# Altium project Q24_ECU.PrjPcb (part 2 of 2)

## Sheet Connectors.SchDoc
size A4
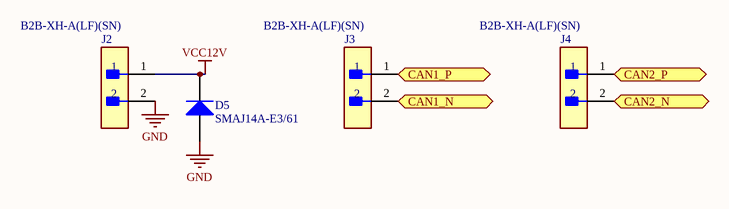
[diagram p6: Connectors.SchDoc]

### Parts
D5  SMAJ14A-E3/61  [VISH-DO-214AC-2_L]
J2  B2B-XH-A(LF)(SN)  [FP-B2B-XH-A_LF_SN-MFG]
J3  B2B-XH-A(LF)(SN)  [FP-B2B-XH-A_LF_SN-MFG]
J4  B2B-XH-A(LF)(SN)  [FP-B2B-XH-A_LF_SN-MFG]

### Ports
CAN1_N (bidir), CAN1_P (bidir), CAN2_N (bidir), CAN2_P (bidir)

### Nets
GND: D5.2(A) J2.2
VCC12V: D5.1(K) J2.1
CAN1_N: J3.2 ; port CAN1_N
CAN1_P: J3.1 ; port CAN1_P
CAN2_N: J4.2 ; port CAN2_N
CAN2_P: J4.1 ; port CAN2_P

### Library data of the parts
D5 = CMP-0548-00224-2: Transient Voltage Suppressor, 6.40 to 231 V, 14 V Stand-off Voltage, Uni-Directional, -55 to 155 degC, 2-pin DO-214AC, Pb-Free, Tape and Reel; Manufacturer: Vishay Semiconductor; PPPM (W): 400, 300; VWM (V): 14; VBR Uni-Directional (V): 6.4 to 231; IFSM: 40 A; ID (uA): 1; PackageDescription: 2-Pin DO-214AC (SMA), Body 4.245 x 2.665 mm; ComponentLink2URL: http://www.vishay.com/docs/88390/smaj50a.pdf; Mounting Technology: Surface Mount; PartNumber: SMAJ14A-E3/61; Operating Junction and Storage Temperature Range: -55 to 150 degC; ComponentLink2Description: Datasheet; Packing: Tape and Reel; PackageReference: DO-214AC-2; ComponentLink3Description: Package Specification; ComponentLink1URL: http://www.vishay.com/; RoHS: TRUE; ComponentLink3URL: http://www.vishay.com/docs/88390/smaj50a.pdf; ComponentLink1Description: Manufacturer URL; DatasheetVersion: 12/8/2013
J2-J4 = CMP-2000-05888-3: CONN HEADER VERT 2POS 2.5MM; Current Rating: 3A; Voltage Rating: 250V; Number of Contacts: 2; Contact Resistance: 20mR; Wire/Cable Gauge: 22AWG; Insulation Resistance: 1GR; Connector Type: Male Pin; Packaging: Bulk; Contact Material: Brass; Lead Free: Lead Free; Orientation: Straight; Contact Plating: Tin; Max Current Rating: 3A; Termination: Solder; Fastening Type: Detent; Depth: 5.75mm; Housing Material: Polyamide; REACH SVHC: No SVHC; Series: XH; Voltage Rating (AC): 250V; Number of Positions: 2; Color: Natural; Contact Type: Male Pin; Max Voltage Rating (DC): 250V; Pitch: 2.5mm; Lead Pitch: 2.5mm; Mount: Through Hole; Max Operating Temperature: 85°C; Length: 7.4mm; Max Voltage Rating (AC): 250V; Min Operating Temperature: -25°C; Number of Rows: 1; Housing Color: White

## Sheet 5VBulkhead.SchDoc
size A4
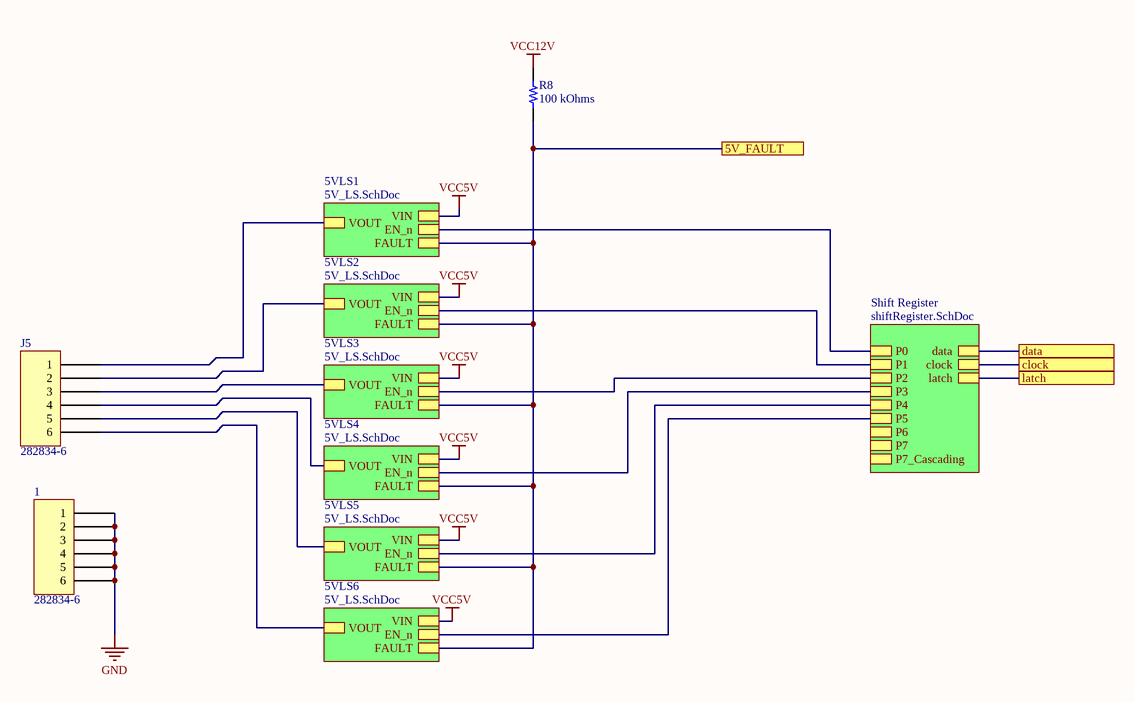
[diagram p7: 5VBulkhead.SchDoc]

### Parts
1  282834-6  [TE 282834-6]
J5  282834-6  [TE 282834-6]
R8  100 kOhms  [RES 0603_1608]

### Sub-sheets
5VLS1 = 5V_LS.SchDoc: VIN, VOUT, EN_n, FAULT
5VLS2 = 5V_LS.SchDoc: VIN, VOUT, EN_n, FAULT
5VLS3 = 5V_LS.SchDoc: VIN, VOUT, EN_n, FAULT
5VLS4 = 5V_LS.SchDoc: VIN, VOUT, EN_n, FAULT
5VLS5 = 5V_LS.SchDoc: VIN, VOUT, EN_n, FAULT
5VLS6 = 5V_LS.SchDoc: VIN, VOUT, EN_n, FAULT
Shift Register = shiftRegister.SchDoc: P0, P1, P2, P3, P4, P5, P6, P7, P7_Cascading, data, clock, latch

### Ports
5V_FAULT, clock, data, latch

### Nets
GND: 1.1 1.2 1.3 1.4 1.5 1.6
VCC5V: sheet 5VLS1/VIN, sheet 5VLS2/VIN, sheet 5VLS3/VIN, sheet 5VLS4/VIN, sheet 5VLS5/VIN, sheet 5VLS6/VIN
VCC12V: R8.2
NetC21_5VLS1_2: J5.1 ; sheet 5VLS1/VOUT
NetC21_5VLS2_2: J5.2 ; sheet 5VLS2/VOUT
NetC21_5VLS3_2: J5.3 ; sheet 5VLS3/VOUT
NetC21_5VLS4_2: J5.4 ; sheet 5VLS4/VOUT
NetC21_5VLS5_2: J5.5 ; sheet 5VLS5/VOUT
NetC21_5VLS6_2: J5.6 ; sheet 5VLS6/VOUT
NetIC2_20: port latch, sheet Shift Register/latch
NetIC2_21: port clock, sheet Shift Register/clock
NetIC2_23: port data, sheet Shift Register/data
NetIC2_42: R8.1 ; port 5V_FAULT, sheet 5VLS1/FAULT, sheet 5VLS2/FAULT, sheet 5VLS3/FAULT, sheet 5VLS4/FAULT, sheet 5VLS5/FAULT, sheet 5VLS6/FAULT
NetIC4_5VLS1_3: sheet Shift Register/P0, sheet 5VLS1/EN_n
NetIC4_5VLS2_3: sheet Shift Register/P1, sheet 5VLS2/EN_n
NetIC4_5VLS3_3: sheet Shift Register/P2, sheet 5VLS3/EN_n
NetIC4_5VLS4_3: sheet Shift Register/P3, sheet 5VLS4/EN_n
NetIC4_5VLS5_3: sheet Shift Register/P4, sheet 5VLS5/EN_n
NetIC4_5VLS6_3: sheet Shift Register/P5, sheet 5VLS6/EN_n

### Library data of the parts
1 J5 = 282834-6: TERM BLK 6P SIDE ENT 2.54MM PCB; Manufacturer: TE Connectivity AMP Connectors; Current: 10A; Mating Orientation: Horizontal with Board; Number of Levels: 1; Pitch: 0.100" (2.54mm); Positions Per Level: 6; Voltage: 150V; Wire Gauge: 16-30 AWG; Wire Termination: Screw - Rising Cage Clamp; Part Number: 282834-6; Color: Green; ComponentLink1Description: Datasheet; ComponentLink1URL: https://www.te.com/commerce/DocumentDelivery/DDEController?Action=srchrtrv&DocNm=282834&DocType=Customer+Drawing&DocLang=English; ComponentLink2Description: DigiKey Link; ComponentLink2URL: http://digikey.com/product-detail/en/te-connectivity-amp-connectors/282834-6/A98337-ND/1153267; LastUpdated: 2020-01-15 4:16:31 AM; Lifecycle Status: Active; Minimum Order: 1; Mounting Type: Through Hole; Packaging: Bulk; Part Status: Active; Price: 4.72; Series: Buchanan; Supplier 1: DigiKey; Supplier Part Number 1: A98337-ND
R8 = RNCS0603BKE100K: RES 100K OHM 0.1% 1/16W 0603; Manufacturer: Stackpole Electronics Inc; Power (Watts): 0.063W, 1/16W; Temperature Coefficient: ±25ppm/°C; Part Number: RNCS0603BKE100K; Value: 100 kOhms; ComponentLink1Description: Datasheet; ComponentLink1URL: https://www.seielect.com/catalog/sei-rncs_rnch.pdf; ComponentLink2Description: DigiKey Link; ComponentLink2URL: https://www.digikey.com/en/products/detail/stackpole-electronics-inc/RNCS0603BKE100K/1708835; Composition: Thin Film; Device Package: 0603 (1608 Metric); Features: Anti-Corrosive, Automotive AEC-Q200, Moisture Resistant; Height - Seated (Max): 0.022" (0.55mm); LastUpdated: 2023-06-08 7:45:17 PM; Lifecycle Status: Active; Minimum Order: 1; Number of Terminations: 2; Operating Temperature: -55°C ~ 155°C; Package / Case: 0603 (1608 Metric); Packaging: TapeAndReel; PartId: 4849; Part Status: Active; Price: 0.07; Ratings: AEC-Q200; Resistance: 100 kOhms; Series: RNCS; Size / Dimension: 0.061" L x 0.031" W (1.55mm x 0.80mm); Supplier 1: DigiKey; Supplier Part Number 1: RNCS0603BKE100KCT-ND; Supplier Device Package: 0603; Tolerance: ±0.1%

## Sheet shiftRegister.SchDoc
size A4
Used 2 times, as channels 5V Power and Ground/Shift Register, 12V Power And Ground/Shift Register. Parts and nets are listed once, with the designators drawn on the sheet.
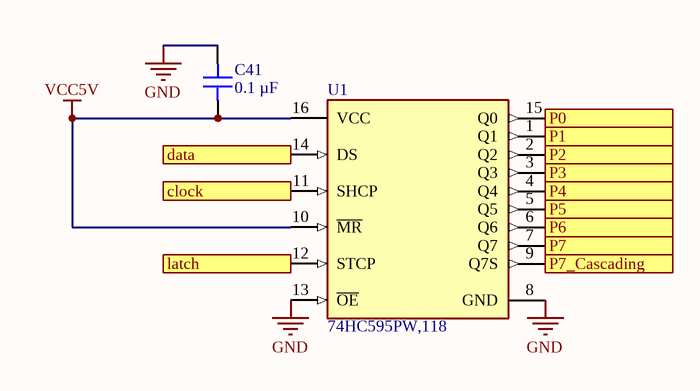
[diagram p8: shiftRegister.SchDoc]

### Parts
C41  0.1 µF  [CAP 0603_1608]
U1  74HC595PW,118  [FP-SOT403-1-MFG]

### Ports
clock, data, latch, P0, P1, P2, P3, P4, P5, P6, P7, P7_Cascading

### Nets
GND: C41.2 U1.8(GND) U1.13(~{OE})
VCC5V: C41.1 U1.10(~{MR}) U1.16(VCC)
clock: U1.11(SHCP) ; port clock
data: U1.14(DS) ; port data
latch: U1.12(STCP) ; port latch
P0: U1.15(Q0) ; port P0
P1: U1.1(Q1) ; port P1
P2: U1.2(Q2) ; port P2
P3: U1.3(Q3) ; port P3
P4: U1.4(Q4) ; port P4
P5: U1.5(Q5) ; port P5
P6: U1.6(Q6) ; port P6
P7: U1.7(Q7) ; port P7
P7_Cascading: U1.9(Q7S) ; port P7_Cascading

### Channels
5V Power and Ground/Shift Register: designators C41=C41_5V_Power_and_Ground_Shift_Register U1=U1_Shift_Register1; ports clock=NetIC2_21 data=NetIC2_23 latch=NetIC2_20 P0=NetIC4_5VLS1_3 P1=NetIC4_5VLS2_3 P2=NetIC4_5VLS3_3 P3=NetIC4_5VLS4_3 P4=NetIC4_5VLS5_3 P5=NetIC4_5VLS6_3 P6=NetU1_Shift_Register1_6 P7=NetU1_Shift_Register1_7 P7_Cascading=NetU1_Shift_Register1_9
12V Power And Ground/Shift Register: designators C41=C41_12V_Power_And_Ground_Shift_Register U1=U1_Shift_Register2; ports clock=12V_CLOCK data=12V_DATA latch=12V_LATCH P0=NetIC5_12V_Power_And_Ground_Designator#1_2 P1=NetIC5_12V_Power_And_Ground_Designator#2_2 P2=NetIC5_12V_Power_And_Ground_Designator#3_2 P3=NetIC5_12V_Power_And_Ground_Designator#4_2 P4=NetIC5_12V_Power_And_Ground_Designator#5_2 P5=NetIC5_12V_Power_And_Ground_Designator#6_2 P6=NetU1_Shift_Register2_6 P7=NetU1_Shift_Register2_7 P7_Cascading=NetU1_Shift_Register2_9

### Library data of the parts
C41 = C0603C104K5RAC7411: CAP CER 0.1UF 50V X7R 0603; manufacturer: KEMET; Tolerance: ±10%; Part Number: C0603C104K5RAC7411; Value: 0.1 µF; Applications: Bypass, Decoupling; Capacitance: 0.1 µF; componentlink1description: Datasheet; componentlink1url: https://api.kemet.com/component-edge/download/datasheet/C0603C104K5RAC7411.pdf; componentlink2description: DigiKey Link; componentlink2url: https://www.digikey.com/en/products/detail/kemet/C0603C104K5RAC7411/3317013; Device Package: 0603 (1608 Metric); lastupdated: 2023-06-20 7:12:54 PM; Lifecycle Status: Active; Minimum Order: 1; Mounting Type: Surface Mount, MLCC; Operating Temperature: -55°C ~ 125°C; Package / Case: 0603 (1608 Metric); packaging: TapeAndReel; partid: 2233; Part Status: Active; price: 0.01; series: SMD Comm X7R; Size / Dimension: 0.063" L x 0.031" W (1.60mm x 0.80mm); Supplier 1: DigiKey; Supplier Part Number 1: 399-C0603C104K5RAC7411CT-ND; Temperature Coefficient: X7R; Thickness (Max): 0.035" (0.90mm); Voltage - Rated: 50V
U1 = CMP-14351-000004-1: IC SHIFT REGISTER 8BIT 16TSSOP

## Sheet 5V_LS.SchDoc
size A4
Used 6 times, as channels 5V Power and Ground/5VLS1, 5V Power and Ground/5VLS2, 5V Power and Ground/5VLS3, 5V Power and Ground/5VLS4, 5V Power and Ground/5VLS5, 5V Power and Ground/5VLS6. Parts and nets are listed once, with the designators drawn on the sheet.
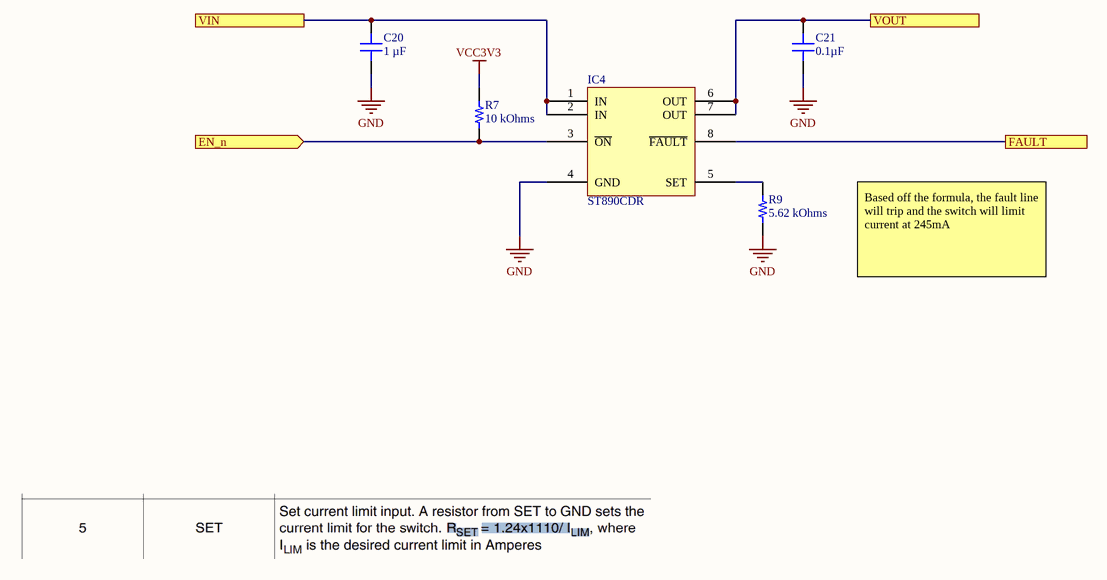
[diagram p9: 5V_LS.SchDoc]

### Parts
C20  1 µF  [CAP 0402_1005]
C21  0.1µF  [CAP 0402_1005]
IC4  ST890CDR  [ST SOIC-8N]
R7  10 kOhms  [RES 0402_1005]
R9  5.62 kOhms  [RES 0402_1005]

### Ports
EN_n (in), FAULT, VIN, VOUT

### Nets
GND: C20.1 C21.1 IC4.4(GND) R9.1
VCC3V3: R7.2
EN_n: IC4.3(~{ON}) R7.1 ; port EN_n
FAULT: IC4.8(~{FAULT}) ; port FAULT
VIN: C20.2 IC4.1(IN) IC4.2(IN) ; port VIN
VOUT: C21.2 IC4.6(OUT) IC4.7(OUT) ; port VOUT
NetIC4_5: IC4.5(SET) R9.2

### Channels
5V Power and Ground/5VLS1: designators end in _5VLS1; ports EN_n=NetIC4_5VLS1_3 FAULT=NetIC2_42 VIN=VCC5V VOUT=NetC21_5VLS1_2
5V Power and Ground/5VLS2: designators end in _5VLS2; ports EN_n=NetIC4_5VLS2_3 FAULT=NetIC2_42 VIN=VCC5V VOUT=NetC21_5VLS2_2
5V Power and Ground/5VLS3: designators end in _5VLS3; ports EN_n=NetIC4_5VLS3_3 FAULT=NetIC2_42 VIN=VCC5V VOUT=NetC21_5VLS3_2
5V Power and Ground/5VLS4: designators end in _5VLS4; ports EN_n=NetIC4_5VLS4_3 FAULT=NetIC2_42 VIN=VCC5V VOUT=NetC21_5VLS4_2
5V Power and Ground/5VLS5: designators end in _5VLS5; ports EN_n=NetIC4_5VLS5_3 FAULT=NetIC2_42 VIN=VCC5V VOUT=NetC21_5VLS5_2
5V Power and Ground/5VLS6: designators end in _5VLS6; ports EN_n=NetIC4_5VLS6_3 FAULT=NetIC2_42 VIN=VCC5V VOUT=NetC21_5VLS6_2

### Notes on the sheet
- Based off the formula, the fault line will trip and the switch will limit current at 245mA

### Library data of the parts
C20 = GRM155C71A105KE11D: CAP CER 1UF 10V X7S 0402; manufacturer: Murata Electronics; Tolerance: ±10%; Part Number: GRM155C71A105KE11D; Value: 1 µF; Applications: General Purpose; Capacitance: 1 µF; componentlink1description: Datasheet; componentlink1url: https://search.murata.co.jp/Ceramy/image/img/A01X/G101/ENG/GRM155C71A105KE11-01.pdf; componentlink2description: DigiKey Link; componentlink2url: https://www.digikey.com/en/products/detail/murata-electronics/GRM155C71A105KE11D/6606086; Device Package: 0402 (1005 Metric); lastupdated: 2023-06-04 7:05:15 PM; Lifecycle Status: Active; Minimum Order: 1; Mounting Type: Surface Mount, MLCC; Operating Temperature: -55°C ~ 125°C; Package / Case: 0402 (1005 Metric); packaging: TapeAndReel; partid: 1749; Part Status: Active; price: 0.01; series: GRM; Size / Dimension: 0.039" L x 0.020" W (1.00mm x 0.50mm); Supplier 1: DigiKey; Supplier Part Number 1: 490-14457-1-ND; Temperature Coefficient: X7S; Thickness (Max): 0.024" (0.60mm); Voltage - Rated: 10V
C21 = 0402ZC104KAT2A: CAP CER 0.1UF 10V X7R 0402; manufacturer: AVX Corporation; Tolerance: ±10%; Part Number: 0402ZC104KAT2A; Value: 0.1µF; Applications: General Purpose; Capacitance: 0.1µF; componentlink1description: Datasheet; componentlink1url: http://datasheets.avx.com/X7RDielectric.pdf; componentlink2description: DigiKey Link; componentlink2url: http://digikey.com/product-detail/en/avx-corporation/0402ZC104KAT2A/478-7891-1-ND/3881514; Device Package: 0402 (1005 Metric); lastupdated: 2022-02-08 12:26:59 PM; Lifecycle Status: Active; Minimum Order: 1; Mounting Type: Surface Mount, MLCC; Operating Temperature: -55°C ~ 125°C; Package / Case: 0402 (1005 Metric); packaging: TapeAndReel; partid: 1757; Part Status: Active; price: 0.09; series: -; Size / Dimension: 0.039" L x 0.020" W (1.00mm x 0.50mm); Supplier 1: DigiKey; Supplier Part Number 1: 478-7891-1-ND; Temperature Coefficient: X7R; Thickness (Max): 0.022" (0.55mm); Voltage - Rated: 10V
IC4 = ST890CDR: IC PWR SWITCH P-CHANNEL 1:1 8SO; Manufacturer: STMicroelectronics; Current - Output (Max): 1.2A; Fault Protection: Current Limiting (Adjustable), Over Temperature; Input Type: Non-Inverting; Interface: On/Off; Number of Outputs: 1; Output Configuration: High Side; Rds On (Typ): 75mOhm; Switch Type: General Purpose; Voltage - Load: 2.7V ~ 5.5V; Voltage - Supply (Vcc/Vdd): Not Required; Part Number: ST890CDR; ComponentLink1Description: Datasheet; ComponentLink1URL: http://www.st.com/content/ccc/resource/technical/document/datasheet/1a/8c/51/d8/96/28/4d/63/CD00002878.pdf/files/CD00002878.pdf/jcr:content/translations/en.CD00002878.pdf; ComponentLink2Description: DigiKey Link; ComponentLink2URL: http://digikey.com/product-detail/en/stmicroelectronics/ST890CDR/497-6543-1-ND/1865325; Device Package: 8-SOIC (0.154", 3.90mm Width); LastUpdated: 2020-05-24 9:33:45 PM; Lifecycle Status: Active; Minimum Order: 1; Mounting Type: Surface Mount; Operating Temperature: -40°C ~ 85°C (TA); Output Type: P-Channel; Package / Case: 8-SOIC (0.154", 3.90mm Width); Packaging: TapeAndReel; Part Status: Active; Price: 0.47; Ratio - Input:Output: 1:1; Series: -; Supplier 1: DigiKey; Supplier Part Number 1: 497-6543-1-ND; Supplier Device Package: 8-SO
R7 = RP73PF1E10KBTD: RES 10K OHM 0.1% 1/10W 0402; Manufacturer: TE Connectivity Passive Product; Power (Watts): 0.1W, 1/10W; Temperature Coefficient: ±25ppm/°C; Part Number: RP73PF1E10KBTD; Value: 10 kOhms; ComponentLink1Description: Datasheet; ComponentLink1URL: https://www.te.com/commerce/DocumentDelivery/DDEController?Action=srchrtrv&DocNm=1773272&DocType=DS&DocLang=English; ComponentLink2Description: DigiKey Link; ComponentLink2URL: https://www.digikey.com/en/products/detail/te-connectivity-passive-product/RP73PF1E10KBTD/8260957; Composition: Thin Film; Device Package: 0402 (1005 Metric); Height - Seated (Max): 0.014" (0.35mm); LastUpdated: 2023-06-04 7:27:27 PM; Lifecycle Status: Active; Minimum Order: 1; Number of Terminations: 2; Operating Temperature: -55°C ~ 155°C; Package / Case: 0402 (1005 Metric); Packaging: TapeAndReel; PartId: 2434; Part Status: Active; Price: 0.08; Resistance: 10 kOhms; Series: RP73, Holsworthy; Size / Dimension: 0.039" L x 0.020" W (1.00mm x 0.50mm); Supplier 1: DigiKey; Supplier Part Number 1: A127415CT-ND; Supplier Device Package: 0402; Tolerance: ±0.1%
R9 = RP73PF1E5K62BTD: RES 5.62K OHM 0.1% 1/10W 0402; Manufacturer: TE Connectivity Passive Product; Power (Watts): 0.1W, 1/10W; Temperature Coefficient: ±25ppm/°C; Part Number: RP73PF1E5K62BTD; Value: 5.62 kOhms; ComponentLink1Description: Datasheet; ComponentLink1URL: https://www.te.com/commerce/DocumentDelivery/DDEController?Action=srchrtrv&DocNm=1773272&DocType=DS&DocLang=English; ComponentLink2Description: DigiKey Link; ComponentLink2URL: https://www.digikey.com/en/products/detail/te-connectivity-passive-product/RP73PF1E5K62BTD/8260933; Composition: Thin Film; Device Package: 0402 (1005 Metric); Height - Seated (Max): 0.014" (0.35mm); LastUpdated: 2023-06-04 7:27:27 PM; Lifecycle Status: Active; Minimum Order: 1; Number of Terminations: 2; Operating Temperature: -55°C ~ 155°C; Package / Case: 0402 (1005 Metric); Packaging: TapeAndReel; PartId: 2425; Part Status: Active; Price: 0.08; Resistance: 5.62 kOhms; Series: RP73, Holsworthy; Size / Dimension: 0.039" L x 0.020" W (1.00mm x 0.50mm); Supplier 1: DigiKey; Supplier Part Number 1: A127391CT-ND; Supplier Device Package: 0402; Tolerance: ±0.1%

## Sheet Debugger.SchDoc
size A4
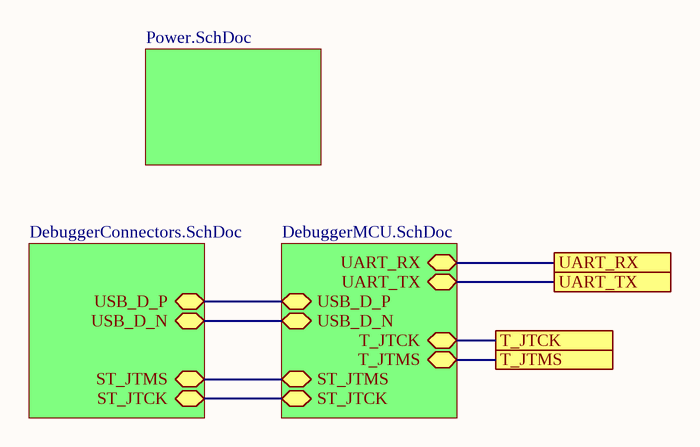
[diagram p10: Debugger.SchDoc]

### Sub-sheets
CONNECTORS = DebuggerConnectors.SchDoc: USB_D_P (bidir), USB_D_N (bidir), ST_JTMS (bidir), ST_JTCK (bidir)
MCU = DebuggerMCU.SchDoc: UART_RX (bidir), UART_TX (bidir), USB_D_P (bidir), USB_D_N (bidir), T_JTCK (bidir), T_JTMS (bidir), ST_JTMS (bidir), ST_JTCK (bidir)
POWER = Power.SchDoc: no entries

### Ports
T_JTCK, T_JTMS, UART_RX, UART_TX

### Nets
ST_JTCK: sheet MCU/ST_JTCK, sheet CONNECTORS/ST_JTCK
ST_JTMS: sheet MCU/ST_JTMS, sheet CONNECTORS/ST_JTMS
T_JTCK: port T_JTCK, sheet MCU/T_JTCK
T_JTMS: port T_JTMS, sheet MCU/T_JTMS
UART_RX: port UART_RX, sheet MCU/UART_RX
UART_TX: port UART_TX, sheet MCU/UART_TX
USB_D_N: sheet MCU/USB_D_N, sheet CONNECTORS/USB_D_N
USB_D_P: sheet MCU/USB_D_P, sheet CONNECTORS/USB_D_P

## Sheet DebuggerMCU.SchDoc
size A4
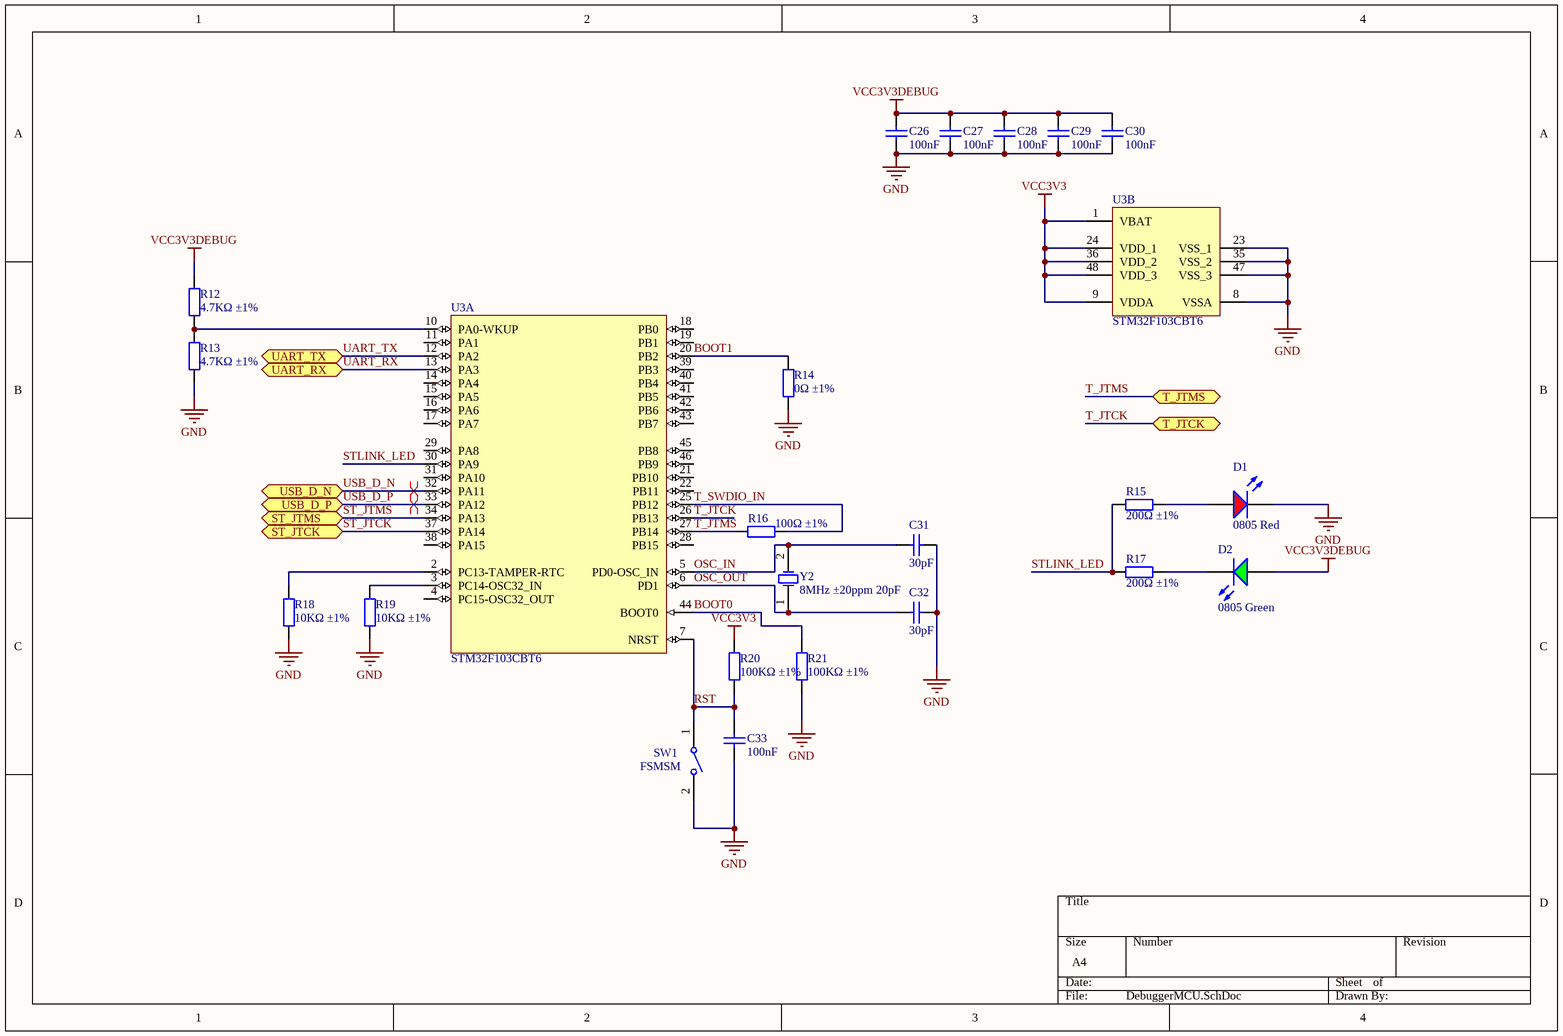
[diagram p11: DebuggerMCU.SchDoc]

### Parts
C26  100nF  [0402_C]
C27  100nF  [0402_C]
C28  100nF  [0402_C]
C29  100nF  [0402_C]
C30  100nF  [0402_C]
C31  30pF  [0402_C]
C32  30pF  [0402_C]
C33  100nF  [0402_C]
D1  0805 Red  [0805_LED_S1]
D2  0805 Green  [0805_LED_S1]
R12  4.7KΩ ±1%  [0805_R]
R13  4.7KΩ ±1%  [0805_R]
R14  0Ω ±1%  [0402_R]
R15  200Ω ±1%  [0402_R]
R16  100Ω ±1%  [0402_R]
R17  200Ω ±1%  [0402_R]
R18  10KΩ ±1%  [0402_R]
R19  10KΩ ±1%  [0402_R]
R20  100KΩ ±1%  [0402_R]
R21  100KΩ ±1%  [0402_R]
SW1  FSMSM  [TECO-FSMSM-2_V]
U3  STM32F103CBT6  [LQFP-48_7x7x05P]  (parts A,B of 2)
Y2  8MHz ±20ppm 20pF  [SMD-5032_2P]

### Ports
ST_JTCK (bidir), ST_JTMS (bidir), T_JTCK (bidir), T_JTMS (bidir), UART_RX (bidir), UART_TX (bidir), USB_D_N (bidir), USB_D_P (bidir)

### Nets
GND: C26.1 C27.1 C28.1 C29.1 C30.1 C31.2 C32.2 C33.1 D1.K R13.1 R14.1 R18.1 R19.1 R21.1 SW1.2 U3.8(VSSA) U3.23(VSS_1) U3.35(VSS_2) U3.47(VSS_3)
VCC3V3: R20.2 U3.1(VBAT) U3.9(VDDA) U3.24(VDD_1) U3.36(VDD_2) U3.48(VDD_3)
VCC3V3DEBUG: C26.2 C27.2 C28.2 C29.2 C30.2 D2.A R12.2
BOOT0: R21.2 U3.44(BOOT0)
BOOT1: R14.2 U3.20(PB2)
OSC_IN: C31.1 U3.5(PD0-OSC_IN) Y2.2(OSC2)
OSC_OUT: C32.1 U3.6(PD1) Y2.1(OSC1)
RST: C33.2 R20.1 SW1.1 U3.7(NRST)
ST_JTCK: U3.37(PA14) ; port ST_JTCK
ST_JTMS: U3.34(PA13) ; port ST_JTMS
STLINK_LED: R15.1 R17.1 U3.30(PA9)
T_JTCK: U3.26(PB13) ; port T_JTCK
T_JTMS: R16.2 U3.27(PB14) ; port T_JTMS
T_SWDIO_IN: R16.1 U3.25(PB12)
UART_RX: U3.13(PA3) ; port UART_RX
UART_TX: U3.12(PA2) ; port UART_TX
USB_D_N: U3.32(PA11) ; port USB_D_N
USB_D_P: U3.33(PA12) ; port USB_D_P
NetD1_A: D1.A R15.2
NetD2_K: D2.K R17.2
NetR12_1: R12.1 R13.2 U3.10(PA0-WKUP)
NetR18_2: R18.2 U3.2(PC13-TAMPER-RTC)
NetR19_2: R19.2 U3.3(PC14-OSC32_IN)

Not connected (* = marked no-connect by the designer): U3 4(PC15-OSC32_OUT) 11(PA1) 14(PA4) 15(PA5) 16(PA6) 17(PA7) 18(PB0) 19(PB1) 21(PB10) 22(PB11) 28(PB15) 29(PA8) 31(PA10) 38(PA15) 39(PB3) 40(PB4) 41(PB5) 42(PB6) 43(PB7) 45(PB8) 46(PB9)

### Layout directives
differential pair: USB_D_N, USB_D_P

### Library data of the parts
C26-C30 C33 = 0402 100nF (104) 10% 16V: Chip capacitors; Manufacturer: Samsung Electro-Mechanics; PartNumber: CL05B104KO5NNNC; Tolerance: 10%; Voltage: 16V; ComponentLink1Description: Supplier link; ComponentLink1URL: http://www.szlcsc.com/product/details_1877.html; Package: 0402; Supplier: LC; SuppliersPartNumber: C1525; Capacitance: 100nF
C31 C32 = 0402 30pF (300) 5% 50V: Chip capacitors; Manufacturer: Guangdong Fenghua Advanced Tech; PartNumber: 0402CG300J500NT; Tolerance: 5%; Voltage: 50V; ComponentLink1Description: Supplier link; ComponentLink1URL: http://www.szlcsc.com/product/details_1922.html; Package: 0402; Supplier: LC; SuppliersPartNumber: C1570; Capacitance: 30pF
D1 = 0805 LED Red: LED; ComponentLink1Description: 供应商链接; ComponentLink1URL: http://www.szlcsc.com/product/details_2668.html; Package: 0805; Supplier: LC; SuppliersPartNumber: C2295; Color: Red
D2 = 0805 LED Green: LED; ComponentLink1Description: 供应商链接; ComponentLink1URL: http://www.szlcsc.com/product/details_2670.html; Package: 0805; Supplier: LC; SuppliersPartNumber: C2297; Color: Green
R12 R13 = 0805 4.7K (4701) 1%: Chip resistor; Manufacturer: Uniroyal Elec; Power: 1/8W; ComponentLink1Description: Supplier link; ComponentLink1URL: http://www.szlcsc.com/product/details_18361.html; Package: 0805; Supplier: LC; SuppliersPartNumber: C17673; Tolerance: 1%
R14 = 0402 0R (0R0) 1%: Chip resistor; Manufacturer: Uniroyal Elec; PartNumber: 0402WGF0000TCE; Power: 1/16W; ComponentLink1Description: Supplier link; ComponentLink1URL: http://www.szlcsc.com/product/details_17853.html; Package: 0402; Supplier: LC; SuppliersPartNumber: C17168; Resistance: 0Ω; Tolerance: 1%
R15 R17 = 0402 200R (2000) 1%: Chip resistor; Manufacturer: Uniroyal Elec; PartNumber: 0402WGF2000TCE; Power: 1/16W; ComponentLink1Description: Supplier link; ComponentLink1URL: http://www.szlcsc.com/product/details_25830.html; Package: 0402; Supplier: LC; SuppliersPartNumber: C25087; Resistance: 200Ω; Tolerance: 1%
R16 = 0402 100R (1000) 1%: Chip resistor; Manufacturer: Uniroyal Elec; PartNumber: 0402WGF1000TCE; Power: 1/16W; ComponentLink1Description: Supplier link; ComponentLink1URL: http://www.szlcsc.com/product/details_25819.html; Package: 0402; Supplier: LC; SuppliersPartNumber: C25076; Resistance: 100Ω; Tolerance: 1%
R18 R19 = 0402 10K (1002) 1%: Chip resistor; Manufacturer: Uniroyal Elec; PartNumber: 0402WGF1002TCE; Power: 1/16W; ComponentLink1Description: Supplier link; ComponentLink1URL: http://www.szlcsc.com/product/details_26487.html; Package: 0402; Supplier: LC; SuppliersPartNumber: C25744; Resistance: 10KΩ; Tolerance: 1%
R20 R21 = 0402 100K (1003) 1%: Chip resistor; Manufacturer: Uniroyal Elec; PartNumber: 0402WGF1003TCE; Power: 1/16W; ComponentLink1Description: Supplier link; ComponentLink1URL: http://www.szlcsc.com/product/details_26484.html; Package: 0402; Supplier: LC; SuppliersPartNumber: C25741; Resistance: 100KΩ; Tolerance: 1%
SW1 = CMP-2000-07511-1: FSMSM Push Button Switch, 50 mA, -35 to 85 degC, 2-Pin SMD, RoHS, Bulk; Manufacturer: TE Connectivity; Actuator Length: 1.07mm; Electrical Life: 20000Cycles; Actuator Material: Polyamide; Current Rating: 50mA; Illumination Type: Illuminated; Voltage Rating (DC): 24V; Contact Resistance: 100mOhm; Case\/Package: SMD/SMT; Operating Force: 180gf; Switch Travel: 0.25mm; Max Voltage Rating (DC): 12V; Throw Configuration: SPST; Packaging: LoosePiece; Max Operating Temperature: 85degC; ELV: Compliant; Package Description: 2-Pin Surface Mount Device, Body 6 x 3.5 mm, Pitch 9.19 mm; RoHSCompliant: true; Manufacturer URL: http://www.te.com/; Contact Plating: Silver; Contact Material: Brass; Mounting Technology: SurfaceMount; Contact Current Rating: 50mA; Datasheet Version: Rev. C2, 08/2014; Datasheet URL: http://www.te.com/commerce/DocumentDelivery/DDEController?Action=showdoc&DocId=Customer+Drawing%7F1437566-3%7FC2%7Fpdf%7FEnglish%7FENG_CD_1437566-3_C2_1437566_3_1_c.dwg.pdf%7F1437566-3; Mechanical Life: 20000Cycles; Package Reference: FSMSM; REACH SVHC: Unknown; Orientation: Straight; Min Operating Temperature: -35degC; Lead Free: LeadFree; Termination: GullWing; Package Quantity: 1000; Mount: SurfaceMount
U3 = STM32F103CBT6: ARM; ComponentLink1Description: 供应商链接; ComponentLink1URL: http://www.szlcsc.com/product/details_8796.html; Package: LQFP-48_7x7x05P; Supplier: LC; SuppliersPartNumber: C8304
Y2 = SMD-5032_2P 8MHz 20ppm 20pF: 贴片晶振; ComponentLink1Description: 供应商链接; ComponentLink1URL: http://www.szlcsc.com/product/details_117214.html; Package: SMD-5032_2P; Supplier: LC; SuppliersPartNumber: C115962

## Sheet Power.SchDoc
size A4
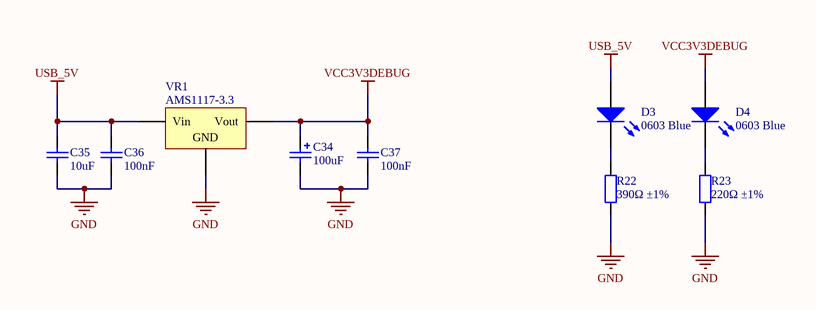
[diagram p12: Power.SchDoc]

### Parts
C34  100uF  [CASE-B_3528]
C35  10uF  [1206_C]
C36  100nF  [0402_C]
C37  100nF  [1206_C]
D3  0603 Blue  [0603_LED_S1]
D4  0603 Blue  [0603_LED_S1]
R22  390Ω ±1%  [0603_R]
R23  220Ω ±1%  [0402_R]
VR1  AMS1117-3.3  [SOT-223]

### Nets
GND: C34.2 C35.1 C36.1 C37.1 R22.1 R23.1 VR1.1(GND)
USB_5V: C35.2 C36.2 D3.A VR1.3(Vin)
VCC3V3DEBUG: C34.1 C37.2 D4.A VR1.2(Vout)
NetD3_K: D3.K R22.2
NetD4_K: D4.K R23.2

### Library data of the parts
C34 = 3528 100uF (107) 10% 6.3V: Tantalum capacitor; Manufacturer: AVX; PartNumber: TAJB107K006RNJ; Tolerance: 10%; Voltage: 6.3V; ComponentLink1Description: Supplier link; ComponentLink1URL: http://www.szlcsc.com/product/details_16815.html; Package: 3528; Supplier: LC; SuppliersPartNumber: C16133; Capacitance: 100uF
C35 = 1206 10uF (106) 10% 50V: Chip capacitors; Manufacturer: Samsung Electro-Mechanics; PartNumber: CL31A106KBHNNNE; Tolerance: 10%; Voltage: 50V; ComponentLink1Description: Supplier link; ComponentLink1URL: http://www.szlcsc.com/product/details_14236.html; Package: 1206; Supplier: LC; SuppliersPartNumber: C13585; Capacitance: 10uF
C36 = 0402 100nF (104) 10% 16V: as C26 on sheet DebuggerMCU; ComponentLink1Description: Supplier link; ComponentLink1URL: http://www.szlcsc.com/product/details_1877.html; Package: 0402; Supplier: LC; SuppliersPartNumber: C1525; Capacitance: 100nF
C37 = 1206 100nF (104) 10% 50V: Chip capacitors; Manufacturer: Samsung Electro-Mechanics; PartNumber: CL31B104KBCNNNC; Tolerance: 10%; Voltage: 50V; ComponentLink1Description: Supplier link; ComponentLink1URL: http://www.szlcsc.com/product/details_25237.html; Package: 1206; Supplier: LC; SuppliersPartNumber: C24497; Capacitance: 100nF
D3 D4 = 0603 LED Blue: LED; ComponentLink1Description: 供应商链接; ComponentLink1URL: http://www.szlcsc.com/product/details_73150.html; Package: 0603; Supplier: LC; SuppliersPartNumber: C72041; Color: Blue
R22 = 0603 390R (3900) 1%: Chip resistor; Manufacturer: Uniroyal Elec; PartNumber: 0603WAF3900T5E; Power: 1/10W; ComponentLink1Description: Supplier link; ComponentLink1URL: http://www.szlcsc.com/product/details_23878.html; Package: 0603; Supplier: LC; SuppliersPartNumber: C23151; Resistance: 390Ω; Tolerance: 1%
R23 = 0402 220R (2200) 1%: Chip resistor; Manufacturer: Uniroyal Elec; PartNumber: 0402WGF2200TCE; Power: 1/16W; ComponentLink1Description: Supplier link; ComponentLink1URL: http://www.szlcsc.com/product/details_25834.html; Package: 0402; Supplier: LC; SuppliersPartNumber: C25091; Resistance: 220Ω; Tolerance: 1%
VR1 = SOT-223 AMS1117-3.3: 低压差线性稳压(LDO); ComponentLink1Description: 供应商链接; ComponentLink1URL: http://www.szlcsc.com/product/details_6652.html; Package: SOT-223; Supplier: LC; SuppliersPartNumber: C6186

## Sheet DebuggerConnectors.SchDoc
size A4
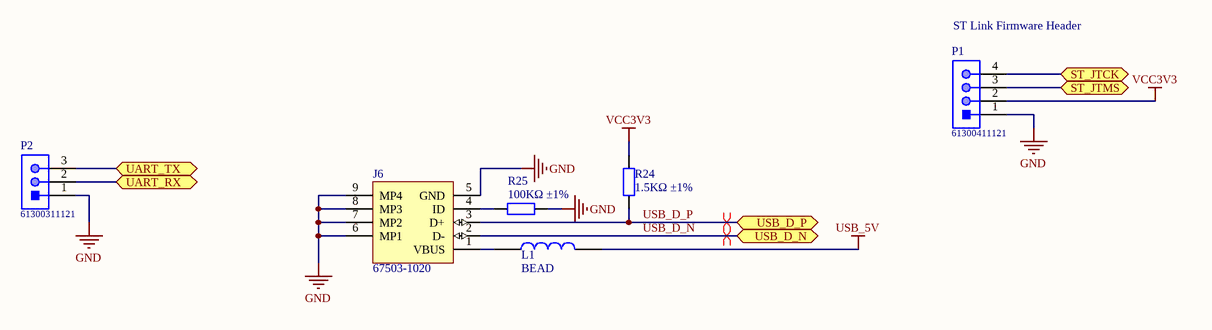
[diagram p13: DebuggerConnectors.SchDoc]

### Parts
J6  67503-1020  [MOLX-67503-1020_V]
L1  BEAD  [0603_L]
P1  61300411121  [61300411121]
P2  61300311121  [61300311121]
R24  1.5KΩ ±1%  [0402_R]
R25  100KΩ ±1%  [0402_R]

### Ports
ST_JTCK (bidir), ST_JTMS (bidir), UART_RX (bidir), UART_TX (bidir), USB_D_N (bidir), USB_D_P (bidir)

### Nets
GND: J6.5(GND) J6.6(MP1) J6.7(MP2) J6.8(MP3) J6.9(MP4) P1.1 P2.1 R25.2
USB_5V: L1.2
VCC3V3: P1.2 R24.2
ST_JTCK: P1.4 ; port ST_JTCK
ST_JTMS: P1.3 ; port ST_JTMS
USB_D_N: J6.2(D-) ; port USB_D_N
USB_D_P: J6.3(D+) R24.1 ; port USB_D_P
NetJ6_1: J6.1(VBUS) L1.1
NetJ6_4: J6.4(ID) R25.1
NetP2_2: P2.2 ; port UART_RX
NetP2_3: P2.3 ; port UART_TX

### Layout directives
differential pair: USB_D_N, USB_D_P

### Notes on the sheet
- (near P1) ST Link Firmware Header

### Library data of the parts
J6 = CMP-0411-00002-1: USB, MINI, SMD, RA KME04-USBMU03A01; Manufacturer: Molex; ComponentLink1URL: http://www.molex.com/; PartNumber: 67503-1020; Mounting Technology: Surface Mount; ComponentLink1Description: Manufacturer URL; Terminal Pitch: 0.8 mm; DatasheetVersion: Rev F, 06/2009; ComponentLink2Description: Datasheet; PackageDescription: Mini USB Connector, SMT, Righer Angle; ComponentLink2URL: http://www.molex.com/pdm_docs/sd/675031020_sd.pdf; PackageReference: 67503-1020
L1 = 0603 100R@100Mhz 1A: Ferrite Bead; Notepad: *; Package: 0603; Supplier: LC; SuppliersPartNumber: C64181
P1 = CMP-1502-01064-1: THT Vertical Pin Header WR-PHD, Pitch 2.54 mm, Single Row, 4 pins; Manufacturer: Wurth Elektronik; Withstanding Voltage: 500VAC; Rated Current: 3A; Working Voltage: 250VAC; Pin Number: 4; Gender: Male; Contact Resistance: 20mOhm; Pitch: 2.54mm; Manufacturer URL: http://www.we-online.de; Operating Temperature: -40to105degC; Packaging: Bag; Mounting Technology: THT; Package Reference: 61300411121; Datasheet URL: https://katalog.we-online.de/em/datasheet/6130xx11121.pdf; Publisher: WurthElektronik; Part Number: 61300411121; Row Number: Single; Orientation: Vertical
P2 = CMP-1502-01062-1: THT Vertical Pin Header WR-PHD, Pitch 2.54 mm, Single Row, 3 pins; Manufacturer: Wurth Elektronik; Withstanding Voltage: 500VAC; Working Voltage: 250VAC; Rated Current: 3A; Pitch: 2.54mm; Pin Number: 3; Gender: Male; Contact Resistance: 20mOhm; Package Reference: 61300311121; Manufacturer URL: http://www.we-online.de; Datasheet URL: https://katalog.we-online.de/em/datasheet/6130xx11121.pdf; Operating Temperature: -40to105degC; Part Number: 61300311121; Orientation: Vertical; Packaging: Bag; Row Number: Single; Mounting Technology: THT; Publisher: WurthElektronik
R24 = 0402 1.5K (1501) 1%: Chip resistor; Manufacturer: Uniroyal Elec; PartNumber: 0402WGF1501TCE; Power: 1/16W; ComponentLink1Description: Supplier link; ComponentLink1URL: http://www.szlcsc.com/product/details_26610.html; Package: 0402; Supplier: LC; SuppliersPartNumber: C25867; Resistance: 1.5KΩ; Tolerance: 1%
R25 = 0402 100K (1003) 1%: as R20 on sheet DebuggerMCU; ComponentLink1Description: Supplier link; ComponentLink1URL: http://www.szlcsc.com/product/details_26484.html; Package: 0402; Supplier: LC; SuppliersPartNumber: C25741; Resistance: 100KΩ; Tolerance: 1%

## Sheet 12V_POWER_BULKHEAD.SchDoc
size A4
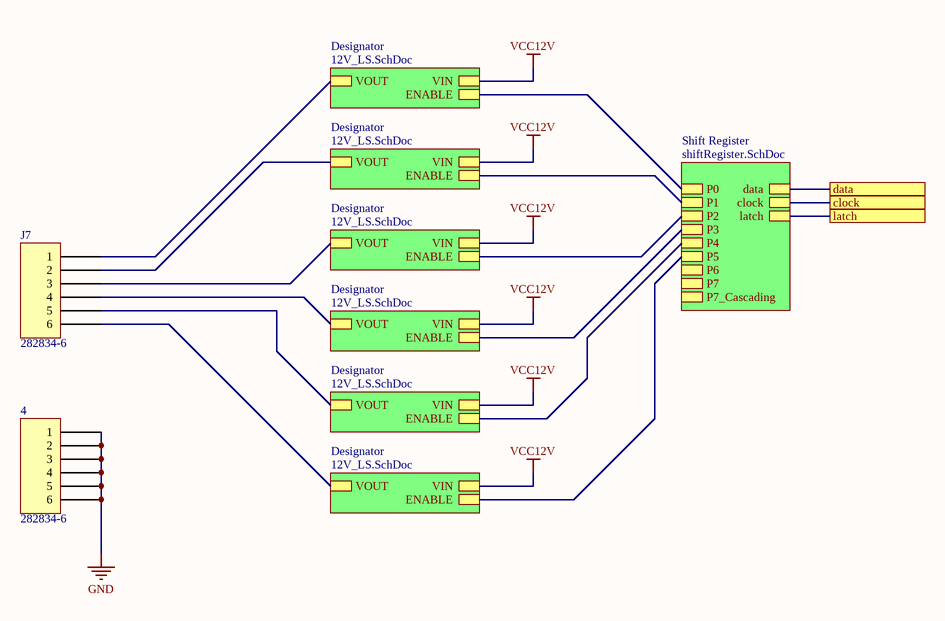
[diagram p14: 12V_POWER_BULKHEAD.SchDoc]

### Parts
4  282834-6  [TE 282834-6]
J7  282834-6  [TE 282834-6]

### Sub-sheets
Designator = 12V_LS.SchDoc: VOUT, ENABLE, VIN
Designator = 12V_LS.SchDoc: VOUT, ENABLE, VIN
Designator = 12V_LS.SchDoc: VOUT, ENABLE, VIN
Designator = 12V_LS.SchDoc: VOUT, ENABLE, VIN
Designator = 12V_LS.SchDoc: VOUT, ENABLE, VIN
Designator = 12V_LS.SchDoc: VOUT, ENABLE, VIN
Shift Register = shiftRegister.SchDoc: P0, P1, P2, P3, P4, P5, P6, P7, P7_Cascading, data, clock, latch

### Ports
clock, data, latch

### Nets
GND: 4.1 4.2 4.3 4.4 4.5 4.6
VCC12V: sheet Designator/VIN, sheet Designator/VIN, sheet Designator/VIN, sheet Designator/VIN, sheet Designator/VIN, sheet Designator/VIN
12V_CLOCK: port clock, sheet Shift Register/clock
12V_DATA: port data, sheet Shift Register/data
12V_LATCH: port latch, sheet Shift Register/latch
NetC39_12V_Power_And_Ground_Designator#1_1: J7.1 ; sheet Designator/VOUT
NetC39_12V_Power_And_Ground_Designator#2_1: J7.2 ; sheet Designator/VOUT
NetC39_12V_Power_And_Ground_Designator#3_1: J7.3 ; sheet Designator/VOUT
NetC39_12V_Power_And_Ground_Designator#4_1: J7.4 ; sheet Designator/VOUT
NetC39_12V_Power_And_Ground_Designator#5_1: J7.5 ; sheet Designator/VOUT
NetC39_12V_Power_And_Ground_Designator#6_1: J7.6 ; sheet Designator/VOUT
NetIC5_12V_Power_And_Ground_Designator#1_2: sheet Shift Register/P0, sheet Designator/ENABLE
NetIC5_12V_Power_And_Ground_Designator#2_2: sheet Shift Register/P1, sheet Designator/ENABLE
NetIC5_12V_Power_And_Ground_Designator#3_2: sheet Shift Register/P2, sheet Designator/ENABLE
NetIC5_12V_Power_And_Ground_Designator#4_2: sheet Shift Register/P3, sheet Designator/ENABLE
NetIC5_12V_Power_And_Ground_Designator#5_2: sheet Shift Register/P4, sheet Designator/ENABLE
NetIC5_12V_Power_And_Ground_Designator#6_2: sheet Shift Register/P5, sheet Designator/ENABLE

### Library data of the parts
4 J7 = 282834-6: as 1 on sheet 5VBulkhead; Part Number: 282834-6; Color: Green; ComponentLink1Description: Datasheet; ComponentLink1URL: https://www.te.com/commerce/DocumentDelivery/DDEController?Action=srchrtrv&DocNm=282834&DocType=Customer+Drawing&DocLang=English; ComponentLink2Description: DigiKey Link; ComponentLink2URL: http://digikey.com/product-detail/en/te-connectivity-amp-connectors/282834-6/A98337-ND/1153267; LastUpdated: 2020-01-15 4:16:31 AM; Lifecycle Status: Active; Minimum Order: 1; Mounting Type: Through Hole; Packaging: Bulk; Part Status: Active; Price: 4.72; Series: Buchanan; Supplier 1: DigiKey; Supplier Part Number 1: A98337-ND

## Sheet Sheet1.SchDoc
size A4

## Nets that join several sheets
GND: TOP (20 pins), STM32 (20 pins), STM32 Microcontroller/CAN1 (C18_CAN1.1 C19_CAN1.1 IC3_CAN1.2), IMU (6 pins), STM32 Microcontroller/CAN2 (C18_CAN2.1 C19_CAN2.1 IC3_CAN2.2), Motor Controller 1 (J8_Motor_Controller_1.2), Motor Controller 1/Designator (5 pins), Motor Controller 2 (J8_Motor_Controller_2.2), Motor Controller 2/Designator (5 pins), Steering (J8_Steering.2), Steering/Designator (5 pins), Connectors (D5.2 J2.2), 5VBulkhead (6 pins), 5V Power and Ground/Shift Register (C41_5V_Power_and_Ground_Shift_Register.2 U1_Shift_Register1.8 U1_Shift_Register1.13), 5V Power and Ground/5VLS1 (C20_5VLS1.1 C21_5VLS1.1 IC4_5VLS1.4 R9_5VLS1.1), 5V Power and Ground/5VLS2 (C20_5VLS2.1 C21_5VLS2.1 IC4_5VLS2.4 R9_5VLS2.1), 5V Power and Ground/5VLS3 (C20_5VLS3.1 C21_5VLS3.1 IC4_5VLS3.4 R9_5VLS3.1), 5V Power and Ground/5VLS4 (C20_5VLS4.1 C21_5VLS4.1 IC4_5VLS4.4 R9_5VLS4.1), 5V Power and Ground/5VLS5 (C20_5VLS5.1 C21_5VLS5.1 IC4_5VLS5.4 R9_5VLS5.1), 5V Power and Ground/5VLS6 (C20_5VLS6.1 C21_5VLS6.1 IC4_5VLS6.4 R9_5VLS6.1), DebuggerMCU (19 pins), Power (7 pins), DebuggerConnectors (8 pins), 12V_POWER_BULKHEAD (6 pins), 12V Power And Ground/Shift Register (C41_12V_Power_And_Ground_Shift_Register.2 U1_Shift_Register2.8 U1_Shift_Register2.13), 12V Power And Ground/Designator (5 pins), 12V Power And Ground/Designator (5 pins), 12V Power And Ground/Designator (5 pins), 12V Power And Ground/Designator (5 pins), 12V Power And Ground/Designator (5 pins), 12V Power And Ground/Designator (5 pins)
USB_5V: Power (C35.2 C36.2 D3.A VR1.3), DebuggerConnectors (L1.2)
VCC3V3: TOP (C4.2 IC1.5 STLINK_HEADER1.2), STM32 (15 pins), STM32 Microcontroller/CAN1 (C18_CAN1.2 IC3_CAN1.5), IMU (5 pins), STM32 Microcontroller/CAN2 (C18_CAN2.2 IC3_CAN2.5), Motor Controller 1/Designator (C40_Motor_Controller_1_Designator.2 IC5_Motor_Controller_1_Designator.3 R10_Motor_Controller_1_Designator.2), Motor Controller 2/Designator (C40_Motor_Controller_2_Designator.2 IC5_Motor_Controller_2_Designator.3 R10_Motor_Controller_2_Designator.2), Steering/Designator (C40_Steering_Designator.2 IC5_Steering_Designator.3 R10_Steering_Designator.2), 5V Power and Ground/5VLS1 (R7_5VLS1.2), 5V Power and Ground/5VLS2 (R7_5VLS2.2), 5V Power and Ground/5VLS3 (R7_5VLS3.2), 5V Power and Ground/5VLS4 (R7_5VLS4.2), 5V Power and Ground/5VLS5 (R7_5VLS5.2), 5V Power and Ground/5VLS6 (R7_5VLS6.2), DebuggerMCU (6 pins), DebuggerConnectors (P1.2 R24.2), 12V Power And Ground/Designator (C40_12V_Power_And_Ground_Designator#1.2 IC5_12V_Power_And_Ground_Designator#1.3 R10_12V_Power_And_Ground_Designator#1.2), 12V Power And Ground/Designator (C40_12V_Power_And_Ground_Designator#2.2 IC5_12V_Power_And_Ground_Designator#2.3 R10_12V_Power_And_Ground_Designator#2.2), 12V Power And Ground/Designator (C40_12V_Power_And_Ground_Designator#3.2 IC5_12V_Power_And_Ground_Designator#3.3 R10_12V_Power_And_Ground_Designator#3.2), 12V Power And Ground/Designator (C40_12V_Power_And_Ground_Designator#4.2 IC5_12V_Power_And_Ground_Designator#4.3 R10_12V_Power_And_Ground_Designator#4.2), 12V Power And Ground/Designator (C40_12V_Power_And_Ground_Designator#5.2 IC5_12V_Power_And_Ground_Designator#5.3 R10_12V_Power_And_Ground_Designator#5.2), 12V Power And Ground/Designator (C40_12V_Power_And_Ground_Designator#6.2 IC5_12V_Power_And_Ground_Designator#6.3 R10_12V_Power_And_Ground_Designator#6.2)
VCC3V3DEBUG: DebuggerMCU (7 pins), Power (C34.1 C37.2 D4.A VR1.2)
VCC5V: TOP (5 pins), STM32 Microcontroller/CAN1 (C19_CAN1.2 IC3_CAN1.3), STM32 Microcontroller/CAN2 (C19_CAN2.2 IC3_CAN2.3), 5V Power and Ground/Shift Register (C41_5V_Power_and_Ground_Shift_Register.1 U1_Shift_Register1.10 U1_Shift_Register1.16), 5V Power and Ground/5VLS1 (C20_5VLS1.2 IC4_5VLS1.1 IC4_5VLS1.2), 5V Power and Ground/5VLS2 (C20_5VLS2.2 IC4_5VLS2.1 IC4_5VLS2.2), 5V Power and Ground/5VLS3 (C20_5VLS3.2 IC4_5VLS3.1 IC4_5VLS3.2), 5V Power and Ground/5VLS4 (C20_5VLS4.2 IC4_5VLS4.1 IC4_5VLS4.2), 5V Power and Ground/5VLS5 (C20_5VLS5.2 IC4_5VLS5.1 IC4_5VLS5.2), 5V Power and Ground/5VLS6 (C20_5VLS6.2 IC4_5VLS6.1 IC4_5VLS6.2), 12V Power And Ground/Shift Register (C41_12V_Power_And_Ground_Shift_Register.1 U1_Shift_Register2.10 U1_Shift_Register2.16)
VCC12V: TOP (C1.2 U4.1), Motor Controller 1/Designator (C38_Motor_Controller_1_Designator.1 IC5_Motor_Controller_1_Designator.1), Motor Controller 2/Designator (C38_Motor_Controller_2_Designator.1 IC5_Motor_Controller_2_Designator.1), Steering/Designator (C38_Steering_Designator.1 IC5_Steering_Designator.1), Connectors (D5.1 J2.1), 5VBulkhead (R8.2), 12V Power And Ground/Designator (C38_12V_Power_And_Ground_Designator#1.1 IC5_12V_Power_And_Ground_Designator#1.1), 12V Power And Ground/Designator (C38_12V_Power_And_Ground_Designator#2.1 IC5_12V_Power_And_Ground_Designator#2.1), 12V Power And Ground/Designator (C38_12V_Power_And_Ground_Designator#3.1 IC5_12V_Power_And_Ground_Designator#3.1), 12V Power And Ground/Designator (C38_12V_Power_And_Ground_Designator#4.1 IC5_12V_Power_And_Ground_Designator#4.1), 12V Power And Ground/Designator (C38_12V_Power_And_Ground_Designator#5.1 IC5_12V_Power_And_Ground_Designator#5.1), 12V Power And Ground/Designator (C38_12V_Power_And_Ground_Designator#6.1 IC5_12V_Power_And_Ground_Designator#6.1)
5V_1_SIG: TOP (2.1), STM32 (IC2.11)
5V_2_SIG: TOP (2.2), STM32 (IC2.24)
5V_3_SIG: TOP (2.3), STM32 (IC2.25)
5V_4_SIG: TOP (2.4), STM32 (IC2.37)
5V_5_SIG: TOP (2.5), STM32 (IC2.38)
5V_6_SIG: TOP (2.6), STM32 (IC2.39)
12V_CLOCK: STM32 (IC2.51), 12V Power And Ground/Shift Register (U1_Shift_Register2.11)
12V_DATA: STM32 (IC2.53), 12V Power And Ground/Shift Register (U1_Shift_Register2.14)
12V_LATCH: STM32 (IC2.50), 12V Power And Ground/Shift Register (U1_Shift_Register2.12)
CAN1_N: STM32 Microcontroller/CAN1 (IC3_CAN1.6), Connectors (J3.2)
CAN1_P: STM32 Microcontroller/CAN1 (IC3_CAN1.7), Connectors (J3.1)
CAN1_RX: STM32 (IC2.44), STM32 Microcontroller/CAN1 (IC3_CAN1.4)
CAN1_STBY: STM32 (IC2.43), STM32 Microcontroller/CAN1 (IC3_CAN1.8)
CAN1_TX: STM32 (IC2.45), STM32 Microcontroller/CAN1 (IC3_CAN1.1)
CAN2_N: STM32 Microcontroller/CAN2 (IC3_CAN2.6), Connectors (J4.2)
CAN2_P: STM32 Microcontroller/CAN2 (IC3_CAN2.7), Connectors (J4.1)
CAN2_RX: STM32 (IC2.57), STM32 Microcontroller/CAN2 (IC3_CAN2.4)
CAN2_STBY: STM32 (IC2.56), STM32 Microcontroller/CAN2 (IC3_CAN2.8)
CAN2_TX: STM32 (IC2.58), STM32 Microcontroller/CAN2 (IC3_CAN2.1)
MC1_ENABLE: STM32 (IC2.26), Motor Controller 1/Designator (IC5_Motor_Controller_1_Designator.2)
MC2_ENABLE: STM32 (IC2.27), Motor Controller 2/Designator (IC5_Motor_Controller_2_Designator.2)
NetC21_5VLS1_2: 5VBulkhead (J5.1), 5V Power and Ground/5VLS1 (C21_5VLS1.2 IC4_5VLS1.6 IC4_5VLS1.7)
NetC21_5VLS2_2: 5VBulkhead (J5.2), 5V Power and Ground/5VLS2 (C21_5VLS2.2 IC4_5VLS2.6 IC4_5VLS2.7)
NetC21_5VLS3_2: 5VBulkhead (J5.3), 5V Power and Ground/5VLS3 (C21_5VLS3.2 IC4_5VLS3.6 IC4_5VLS3.7)
NetC21_5VLS4_2: 5VBulkhead (J5.4), 5V Power and Ground/5VLS4 (C21_5VLS4.2 IC4_5VLS4.6 IC4_5VLS4.7)
NetC21_5VLS5_2: 5VBulkhead (J5.5), 5V Power and Ground/5VLS5 (C21_5VLS5.2 IC4_5VLS5.6 IC4_5VLS5.7)
NetC21_5VLS6_2: 5VBulkhead (J5.6), 5V Power and Ground/5VLS6 (C21_5VLS6.2 IC4_5VLS6.6 IC4_5VLS6.7)
NetC39_12V_Power_And_Ground_Designator#1_1: 12V_POWER_BULKHEAD (J7.1), 12V Power And Ground/Designator (C39_12V_Power_And_Ground_Designator#1.1 IC5_12V_Power_And_Ground_Designator#1.7 IC5_12V_Power_And_Ground_Designator#1.8 R11_12V_Power_And_Ground_Designator#1.1)
NetC39_12V_Power_And_Ground_Designator#2_1: 12V_POWER_BULKHEAD (J7.2), 12V Power And Ground/Designator (C39_12V_Power_And_Ground_Designator#2.1 IC5_12V_Power_And_Ground_Designator#2.7 IC5_12V_Power_And_Ground_Designator#2.8 R11_12V_Power_And_Ground_Designator#2.1)
NetC39_12V_Power_And_Ground_Designator#3_1: 12V_POWER_BULKHEAD (J7.3), 12V Power And Ground/Designator (C39_12V_Power_And_Ground_Designator#3.1 IC5_12V_Power_And_Ground_Designator#3.7 IC5_12V_Power_And_Ground_Designator#3.8 R11_12V_Power_And_Ground_Designator#3.1)
NetC39_12V_Power_And_Ground_Designator#4_1: 12V_POWER_BULKHEAD (J7.4), 12V Power And Ground/Designator (C39_12V_Power_And_Ground_Designator#4.1 IC5_12V_Power_And_Ground_Designator#4.7 IC5_12V_Power_And_Ground_Designator#4.8 R11_12V_Power_And_Ground_Designator#4.1)
NetC39_12V_Power_And_Ground_Designator#5_1: 12V_POWER_BULKHEAD (J7.5), 12V Power And Ground/Designator (C39_12V_Power_And_Ground_Designator#5.1 IC5_12V_Power_And_Ground_Designator#5.7 IC5_12V_Power_And_Ground_Designator#5.8 R11_12V_Power_And_Ground_Designator#5.1)
NetC39_12V_Power_And_Ground_Designator#6_1: 12V_POWER_BULKHEAD (J7.6), 12V Power And Ground/Designator (C39_12V_Power_And_Ground_Designator#6.1 IC5_12V_Power_And_Ground_Designator#6.7 IC5_12V_Power_And_Ground_Designator#6.8 R11_12V_Power_And_Ground_Designator#6.1)
NetC39_Motor_Controller_1_Designator_1: Motor Controller 1 (J8_Motor_Controller_1.1), Motor Controller 1/Designator (C39_Motor_Controller_1_Designator.1 IC5_Motor_Controller_1_Designator.7 IC5_Motor_Controller_1_Designator.8 R11_Motor_Controller_1_Designator.1)
NetC39_Motor_Controller_2_Designator_1: Motor Controller 2 (J8_Motor_Controller_2.1), Motor Controller 2/Designator (C39_Motor_Controller_2_Designator.1 IC5_Motor_Controller_2_Designator.7 IC5_Motor_Controller_2_Designator.8 R11_Motor_Controller_2_Designator.1)
NetC39_Steering_Designator_1: Steering (J8_Steering.1), Steering/Designator (C39_Steering_Designator.1 IC5_Steering_Designator.7 IC5_Steering_Designator.8 R11_Steering_Designator.1)
NetIC2_8: STM32 (IC2.8), IMU (U2.6)
NetIC2_14: TOP (R3.2), STM32 (IC2.14)
NetIC2_15: TOP (R4.2), STM32 (IC2.15)
NetIC2_20: STM32 (IC2.20), 5V Power and Ground/Shift Register (U1_Shift_Register1.12)
NetIC2_21: STM32 (IC2.21), 5V Power and Ground/Shift Register (U1_Shift_Register1.11)
NetIC2_23: STM32 (IC2.23), 5V Power and Ground/Shift Register (U1_Shift_Register1.14)
NetIC2_33: STM32 (IC2.33), IMU (U2.5)
NetIC2_34: STM32 (IC2.34), IMU (U2.2)
NetIC2_35: STM32 (IC2.35), IMU (U2.4)
NetIC2_36: STM32 (IC2.36), IMU (U2.3)
NetIC2_42: STM32 (IC2.42), 5VBulkhead (R8.1), 5V Power and Ground/5VLS1 (IC4_5VLS1.8), 5V Power and Ground/5VLS2 (IC4_5VLS2.8), 5V Power and Ground/5VLS3 (IC4_5VLS3.8), 5V Power and Ground/5VLS4 (IC4_5VLS4.8), 5V Power and Ground/5VLS5 (IC4_5VLS5.8), 5V Power and Ground/5VLS6 (IC4_5VLS6.8)
NetIC2_46: TOP (R2.2 STLINK_HEADER1.3), STM32 (IC2.46)
NetIC2_49: TOP (R1.2 STLINK_HEADER1.4), STM32 (IC2.49)
NetIC4_5VLS1_3: 5V Power and Ground/Shift Register (U1_Shift_Register1.15), 5V Power and Ground/5VLS1 (IC4_5VLS1.3 R7_5VLS1.1)
NetIC4_5VLS2_3: 5V Power and Ground/Shift Register (U1_Shift_Register1.1), 5V Power and Ground/5VLS2 (IC4_5VLS2.3 R7_5VLS2.1)
NetIC4_5VLS3_3: 5V Power and Ground/Shift Register (U1_Shift_Register1.2), 5V Power and Ground/5VLS3 (IC4_5VLS3.3 R7_5VLS3.1)
NetIC4_5VLS4_3: 5V Power and Ground/Shift Register (U1_Shift_Register1.3), 5V Power and Ground/5VLS4 (IC4_5VLS4.3 R7_5VLS4.1)
NetIC4_5VLS5_3: 5V Power and Ground/Shift Register (U1_Shift_Register1.4), 5V Power and Ground/5VLS5 (IC4_5VLS5.3 R7_5VLS5.1)
NetIC4_5VLS6_3: 5V Power and Ground/Shift Register (U1_Shift_Register1.5), 5V Power and Ground/5VLS6 (IC4_5VLS6.3 R7_5VLS6.1)
NetIC5_12V_Power_And_Ground_Designator#1_2: 12V Power And Ground/Shift Register (U1_Shift_Register2.15), 12V Power And Ground/Designator (IC5_12V_Power_And_Ground_Designator#1.2)
NetIC5_12V_Power_And_Ground_Designator#2_2: 12V Power And Ground/Shift Register (U1_Shift_Register2.1), 12V Power And Ground/Designator (IC5_12V_Power_And_Ground_Designator#2.2)
NetIC5_12V_Power_And_Ground_Designator#3_2: 12V Power And Ground/Shift Register (U1_Shift_Register2.2), 12V Power And Ground/Designator (IC5_12V_Power_And_Ground_Designator#3.2)
NetIC5_12V_Power_And_Ground_Designator#4_2: 12V Power And Ground/Shift Register (U1_Shift_Register2.3), 12V Power And Ground/Designator (IC5_12V_Power_And_Ground_Designator#4.2)
NetIC5_12V_Power_And_Ground_Designator#5_2: 12V Power And Ground/Shift Register (U1_Shift_Register2.4), 12V Power And Ground/Designator (IC5_12V_Power_And_Ground_Designator#5.2)
NetIC5_12V_Power_And_Ground_Designator#6_2: 12V Power And Ground/Shift Register (U1_Shift_Register2.5), 12V Power And Ground/Designator (IC5_12V_Power_And_Ground_Designator#6.2)
SIG_12V_1: TOP (3.1), STM32 (IC2.59)
SIG_12V_2: TOP (3.2), STM32 (IC2.61)
SIG_12V_3: TOP (3.3), STM32 (IC2.62)
SIG_12V_4: TOP (3.4), STM32 (IC2.29)
SIG_12V_5: TOP (3.5), STM32 (IC2.9)
SIG_12V_6: TOP (3.6), STM32 (IC2.10)
ST_JTCK: DebuggerMCU (U3.37), DebuggerConnectors (P1.4)
ST_JTMS: DebuggerMCU (U3.34), DebuggerConnectors (P1.3)
STEERING_ENABLE: STM32 (IC2.40), Steering/Designator (IC5_Steering_Designator.2)
T_JTCK: TOP (R1.1), DebuggerMCU (U3.26)
T_JTMS: TOP (R2.1), DebuggerMCU (R16.2 U3.27)
UART_RX: TOP (R3.1), DebuggerMCU (U3.13)
UART_TX: TOP (R4.1), DebuggerMCU (U3.12)
USB_D_N: DebuggerMCU (U3.32), DebuggerConnectors (J6.2)
USB_D_P: DebuggerMCU (U3.33), DebuggerConnectors (J6.3 R24.1)